# Altium schematic sheet [19] - DOC REVISION HISTORY.SchDoc
size A3; DocumentNumber: 19; SheetNumber: 19; SheetTotal: 20
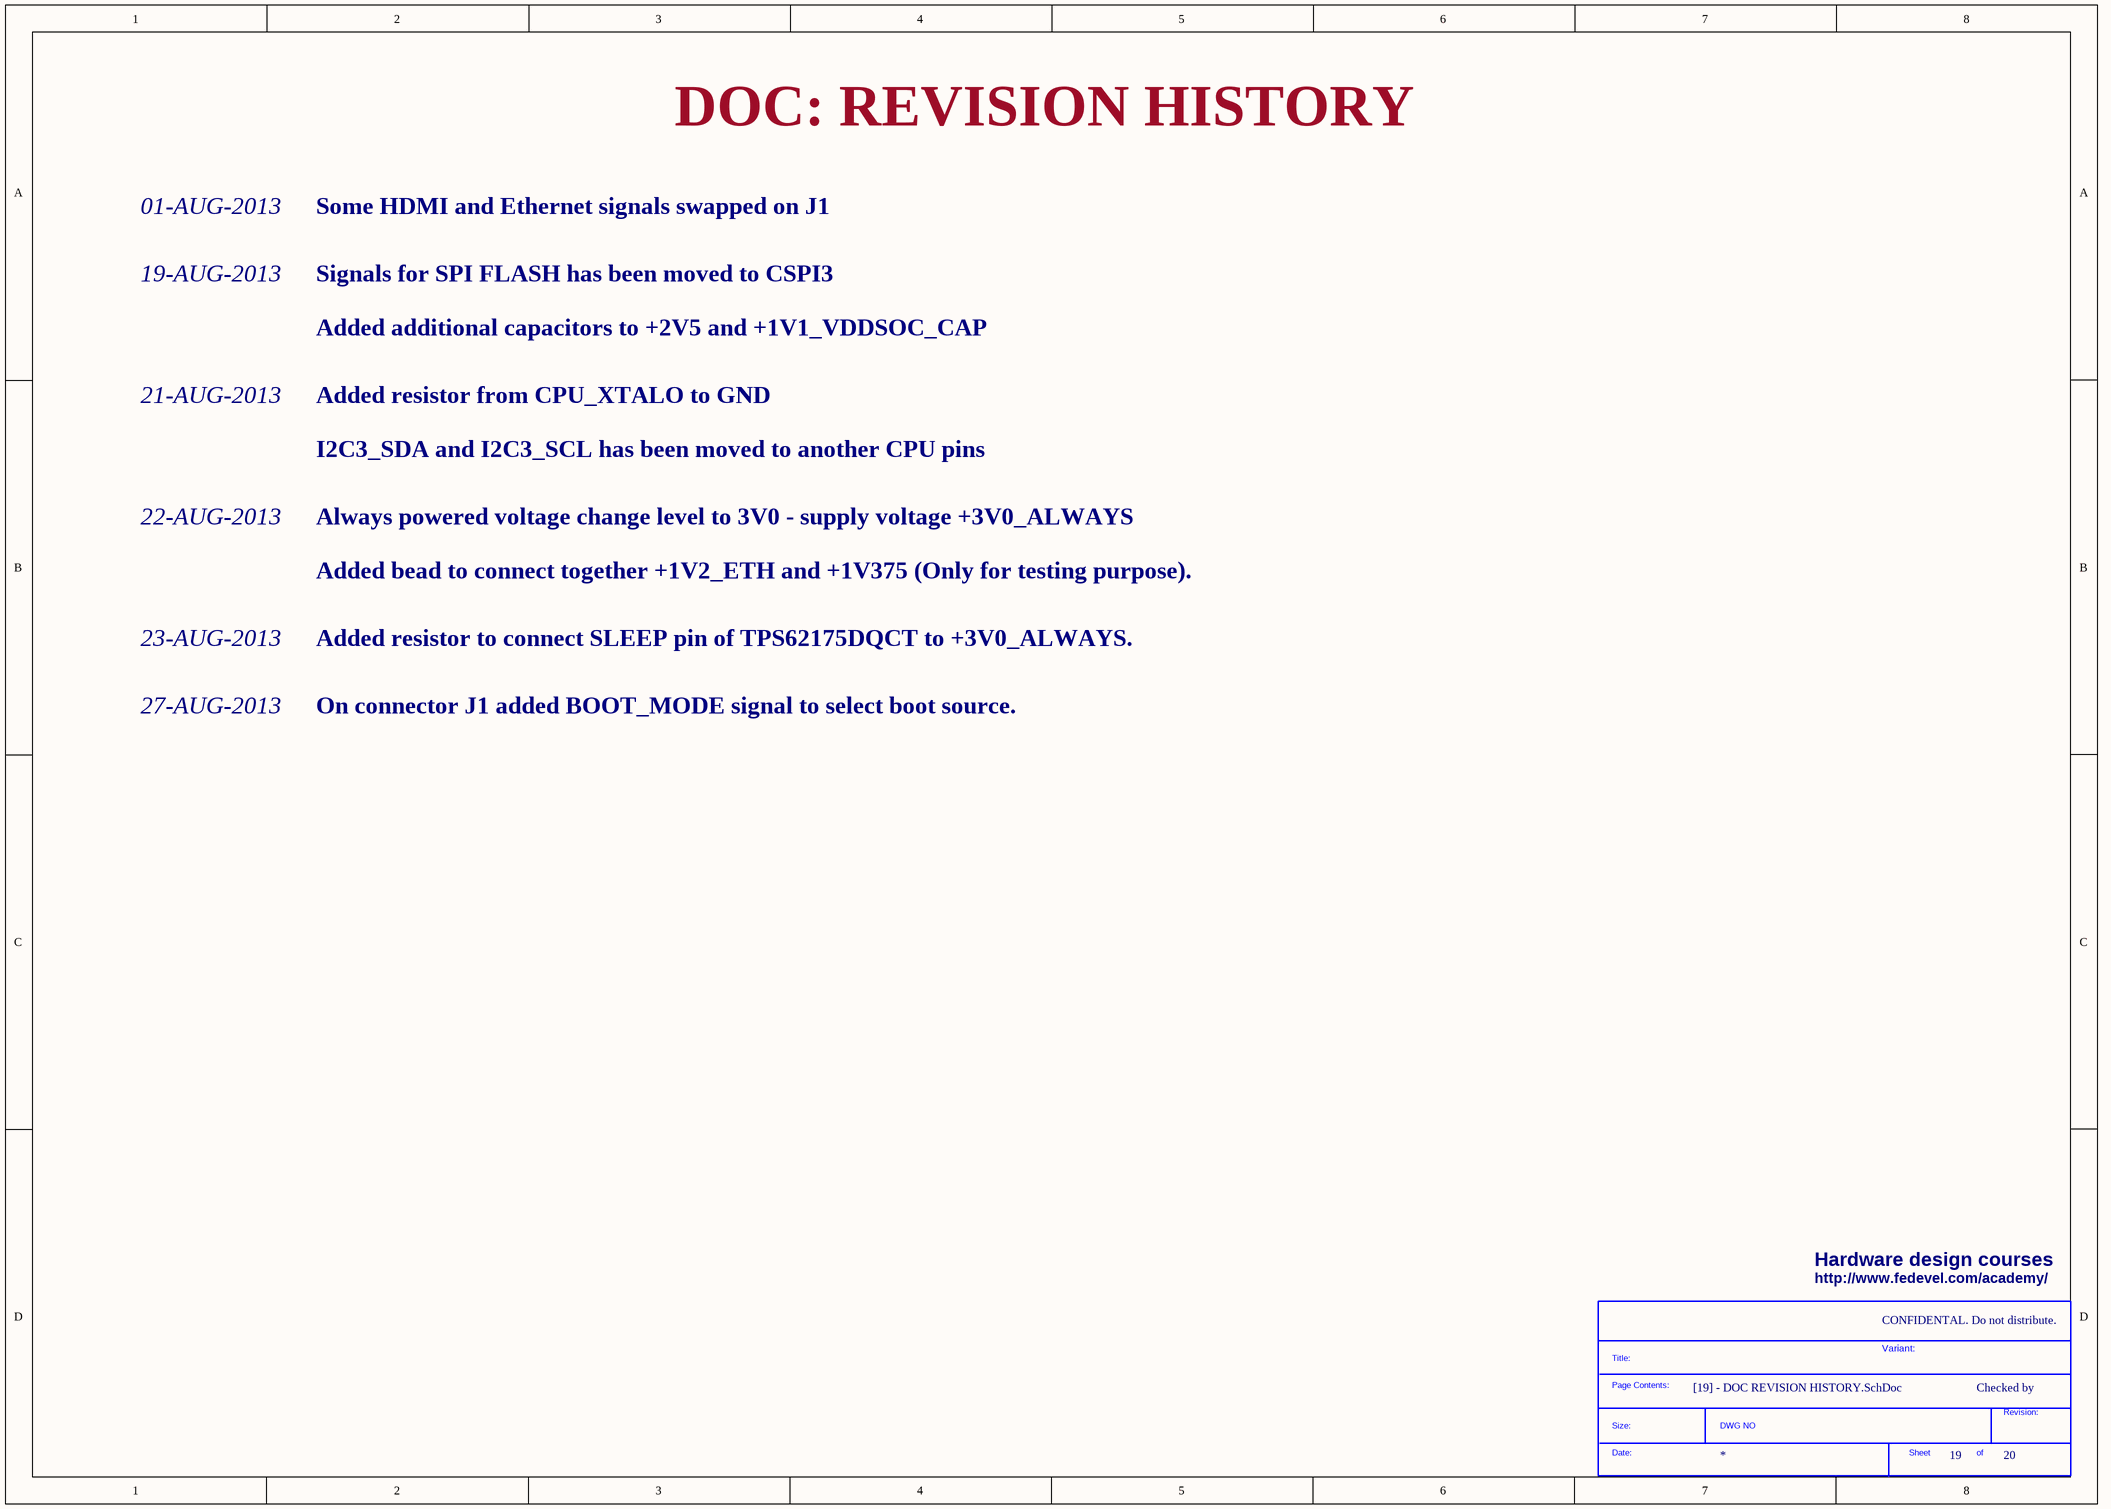
[diagram p0: [19] - DOC REVISION HISTORY.SchDoc]

## Parts
*  SDTitleBlock  (value not drawn)  (graphical)

## Notes on the sheet
- DOC: REVISION HISTORY
- 01-AUG-2013
- Some HDMI and Ethernet signals swapped on J1
- 19-AUG-2013
- Signals for SPI FLASH has been moved to CSPI3
- Added additional capacitors to +2V5 and +1V1_VDDSOC_CAP
- 21-AUG-2013
- Added resistor from CPU_XTALO to GND
- I2C3_SDA and I2C3_SCL has been moved to another CPU pins
- 22-AUG-2013
- Always powered voltage change level to 3V0 - supply voltage +3V0_ALWAYS
- Added bead to connect together +1V2_ETH and +1V375 (Only for testing purpose).
- 23-AUG-2013
- Added resistor to connect SLEEP pin of TPS62175DQCT to +3V0_ALWAYS.
- 27-AUG-2013
- On connector J1 added BOOT_MODE signal to select boot source.
- Hardware design courses
- http://www.fedevel.com/academy/
- CONFIDENTAL. Do not distribute.
- Variant:
- Checked by
- CLOCKS (CPU & PCIE)
- (in symbol SDTitleBlock) Title:; Page Contents:; Revision:; Size:; DWG NO; Date:; Sheet; of